# EAGLE design k22-brd (EAGLE 9.6.2)
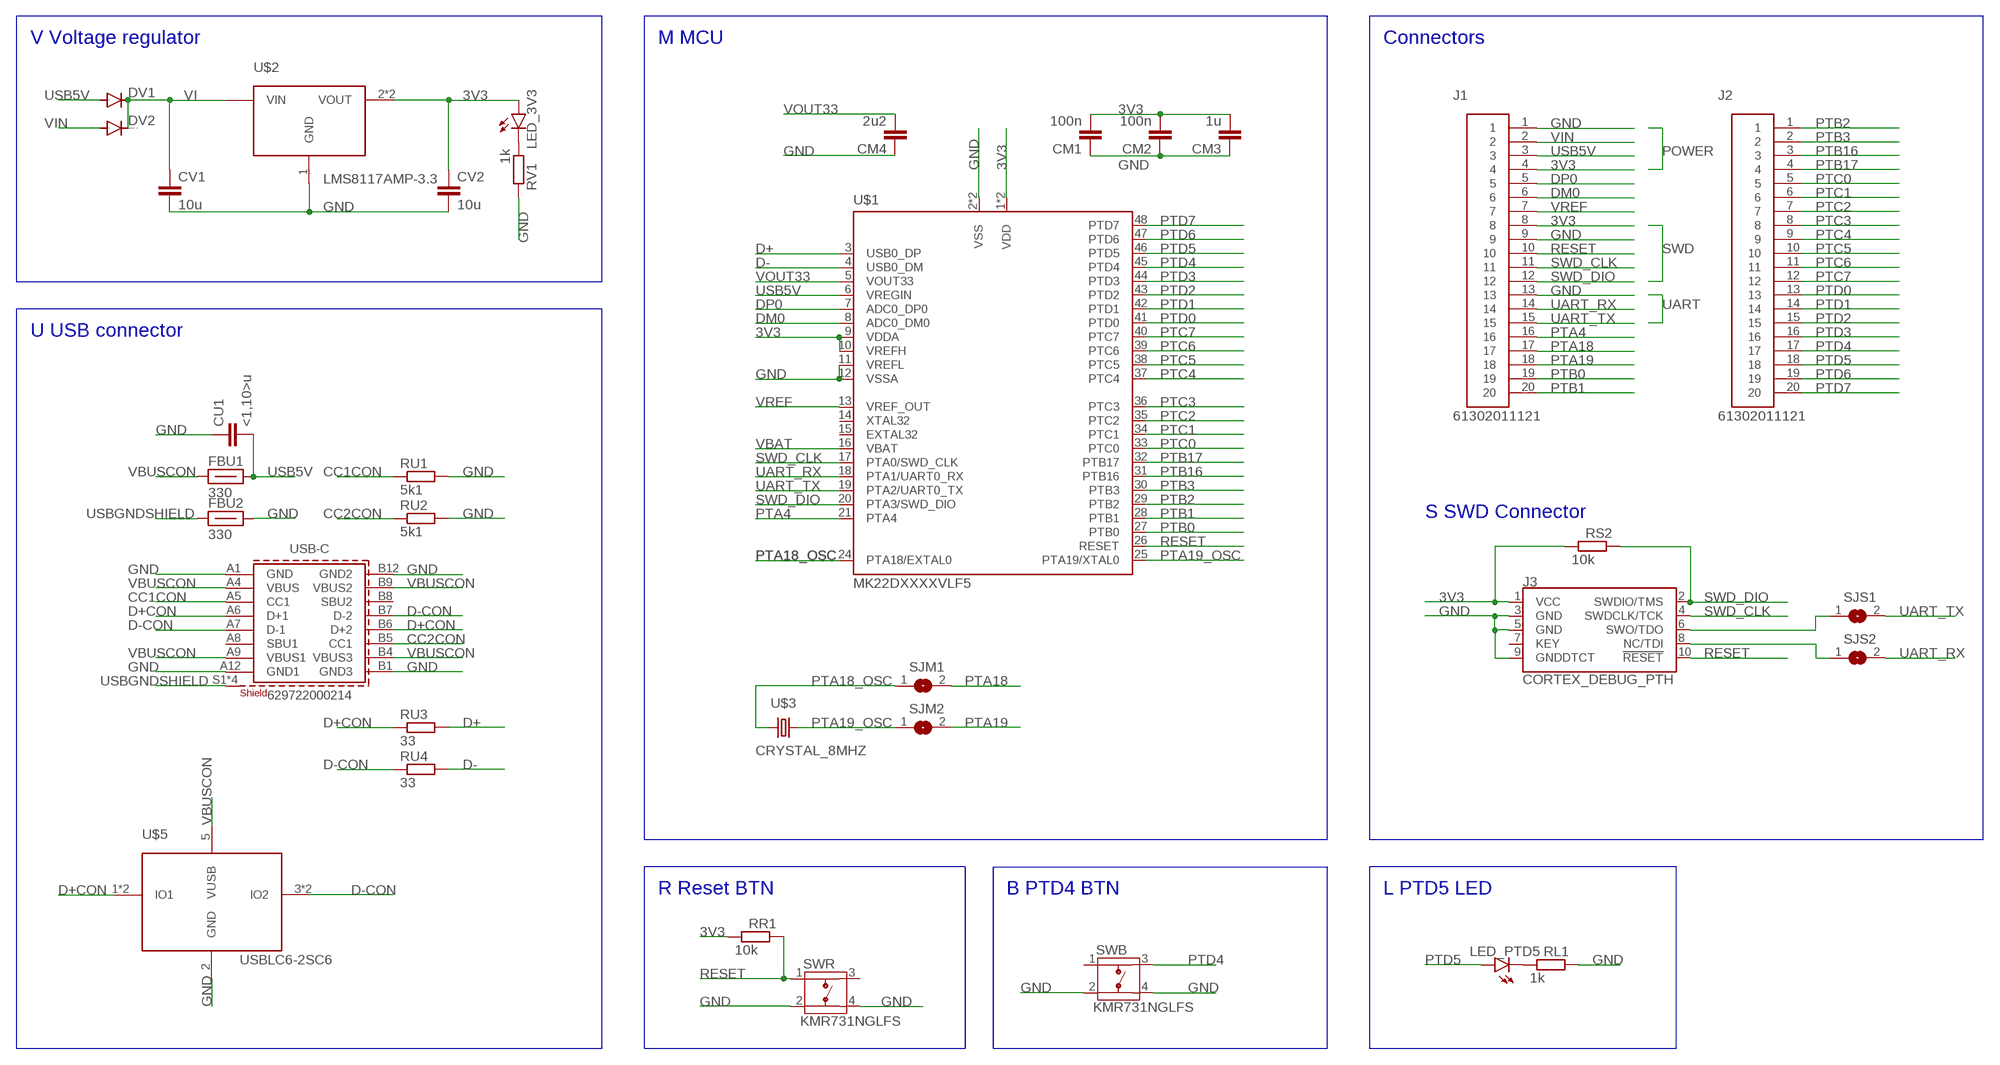
[diagram p0: schematic, sheet 1]

## Parts
CM1  100n  C-EUC0805  [C0805]
CM2  100n  C-EUC0805  [C0805]
CM3  1u  C-EUC0805  [C0805]
CM4  2u2  C-EUC0805  [C0805]
CU1  <1,10>u  C-EUC0805  [C0805]
CV1  10u  C-EUC0805  [C0805]
CV2  10u  C-EUC0805  [C0805]
DV1  DIODE-DO214AC  [DO214AC]
DV2  DIODE-DO214AC  [DO214AC]
FBU1  330  GHI-BASICCOMPONENTS_FB-(INCH)-0805  [GHI-BASICCOMPONENTS_0805-RESISTOR]
FBU2  330  GHI-BASICCOMPONENTS_FB-(INCH)-0805  [GHI-BASICCOMPONENTS_0805-RESISTOR]
J1  61302011121  [61302011121]
J2  61302011121  [61302011121]
J3  CORTEX_DEBUG_PTH  [2X5-PTH-1.27MM]
LED_3V3  LEDCHIP-LED0805  [CHIP-LED0805]
LED_PTD5  LEDCHIP-LED0805  [CHIP-LED0805]
RL1  1k  R-EU_M0805  [M0805]
RR1  10k  R-EU_M0805  [M0805]
RS2  10k  R-EU_M0805  [M0805]
RU1  5k1  R-EU_R0805  [R0805]
RU2  5k1  R-EU_R0805  [R0805]
RU3  33  R-EU_R0805  [R0805]
RU4  33  R-EU_R0805  [R0805]
RV1  1k  R-EU_M0805  [M0805]
SJM1  SJ  [SJ]
SJM2  SJ  [SJ]
SJS1  SJ  [SJ]
SJS2  SJ  [SJ]
SWB  KMR731NGLFS  [KMR731NGLFS]
SWR  KMR731NGLFS  [KMR731NGLFS]
U$1  MK22DXXXXVLF5  [TQFP48_7X7]
U$2  LMS8117AMP-3.3  [SOT223]
U$3  CRYSTAL_8MHZ  [CRYSTAL-SMD-5X3.2-2PAD]
U$5  USBLC6-2SC6  [SOT23-6L]
USB-C  629722000214  [629722000214]

## Nets
3V3: CM1.2 CM2.2 CM3.2 CV2.1 J1.4 J1.8 J3.1(VCC) LED_3V3.A RR1.1 RS2.1 U$1.1(VDD) U$1.9(VDDA) U$1.10(VREFH) U$1.22(VDD) U$2.2(VOUT) U$2.4(VOUT)
CC1CON: RU1.1 USB-C.A5(CC1)
CC2CON: RU2.1 USB-C.B5(CC1)
D+: RU3.2 U$1.3(USB0_DP)
D+CON: RU3.1 U$5.1(IO1) U$5.6(IO1) USB-C.A6(D+1) USB-C.B6(D+2)
D-: RU4.2 U$1.4(USB0_DM)
D-CON: RU4.1 U$5.3(IO2) U$5.4(IO2) USB-C.A7(D-1) USB-C.B7(D-2)
DM0: J1.6 U$1.8(ADC0_DM0)
DP0: J1.5 U$1.7(ADC0_DP0)
GND: CM1.1 CM2.1 CM3.1 CM4.1 CU1.1 CV1.2 CV2.2 FBU2.2 J1.1 J1.9 J1.13 J3.3(GND) J3.5(GND) J3.9(GNDDTCT) RL1.2 RU1.2 RU2.2 RV1.2 SWB.2 SWB.4 SWR.2 SWR.4 U$1.2(VSS) U$1.11(VREFL) U$1.12(VSSA) U$1.23(VSS) U$2.1(GND) U$5.2(GND) USB-C.A1(GND) USB-C.A12(GND1) USB-C.B1(GND3) USB-C.B12(GND2)
N$1: LED_PTD5.C RL1.1
N$2: LED_3V3.C RV1.1
N$3: J3.8(NC/TDI) SJS2.1
N$4: J3.6(SWO/TDO) SJS1.1
PTA4: J1.16 U$1.21(PTA4)
PTA18: J1.17 SJM1.2
PTA18_OSC: SJM1.1 U$1.24(PTA18/EXTAL0) U$3.1
PTA19: J1.18 SJM2.2
PTA19_OSC: SJM2.1 U$1.25(PTA19/XTAL0) U$3.2
PTB0: J1.19 U$1.27(PTB0)
PTB1: J1.20 U$1.28(PTB1)
PTB2: J2.1 U$1.29(PTB2)
PTB3: J2.2 U$1.30(PTB3)
PTB16: J2.3 U$1.31(PTB16)
PTB17: J2.4 U$1.32(PTB17)
PTC0: J2.5 U$1.33(PTC0)
PTC1: J2.6 U$1.34(PTC1)
PTC2: J2.7 U$1.35(PTC2)
PTC3: J2.8 U$1.36(PTC3)
PTC4: J2.9 U$1.37(PTC4)
PTC5: J2.10 U$1.38(PTC5)
PTC6: J2.11 U$1.39(PTC6)
PTC7: J2.12 U$1.40(PTC7)
PTD0: J2.13 U$1.41(PTD0)
PTD1: J2.14 U$1.42(PTD1)
PTD2: J2.15 U$1.43(PTD2)
PTD3: J2.16 U$1.44(PTD3)
PTD4: J2.17 SWB.3 U$1.45(PTD4)
PTD5: J2.18 LED_PTD5.A U$1.46(PTD5)
PTD6: J2.19 U$1.47(PTD6)
PTD7: J2.20 U$1.48(PTD7)
RESET: J1.10 J3.10(!RESET) RR1.2 SWR.1 U$1.26(RESET)
SWD_CLK: J1.11 J3.4(SWDCLK/TCK) U$1.17(PTA0/SWD_CLK)
SWD_DIO: J1.12 J3.2(SWDIO/TMS) RS2.2 U$1.20(PTA3/SWD_DIO)
UART_RX: J1.14 SJS2.2 U$1.18(PTA1/UART0_RX)
UART_TX: J1.15 SJS1.2 U$1.19(PTA2/UART0_TX)
USB5V: CU1.2 DV1.A FBU1.2 J1.3 U$1.6(VREGIN)
USBGNDSHIELD: FBU2.1 USB-C.S1(SHIELD) USB-C.S2(SHIELD) USB-C.S3(SHIELD) USB-C.S4(SHIELD)
VBAT: U$1.16(VBAT)
VBUSCON: FBU1.1 U$5.5(VUSB) USB-C.A4(VBUS) USB-C.A9(VBUS1) USB-C.B4(VBUS3) USB-C.B9(VBUS2)
VI: CV1.1 DV1.C DV2.C U$2.3(VIN)
VIN: DV2.A J1.2
VOUT33: CM4.2 U$1.5(VOUT33)
VREF: J1.7 U$1.13(VREF_OUT)
Unconnected: J3.7(KEY) SWB.1 SWR.3 U$1.14(XTAL32) U$1.15(EXTAL32) USB-C.A8(SBU1) USB-C.B8(SBU2)

## Notes on the sheet
- V Voltage regulator | M MCU | Connectors
- U USB connector
- S SWD Connector
- R Reset BTN | B PTD4 BTN | L PTD5 LED

## Library data of the parts
CM1-CM4 CU1 CV1 CV2 = rcl:C-EU: CAPACITOR, European symbol; SPICEPREFIX: C
DV1 DV2 = diode:DIODE-: DIODE
FBU1 FBU2 = BeagleBone_Black_Wireless:GHI-BASICCOMPONENTS_FB-(INCH)-
J1 J2 = Headers:61302011121: CONN HEADER VERT 20POS 2.54MM Manufacturer's datasheet <https://katalog.we-online.de/em/datasheet/6130xx11121.pdf>; CREATED_BY: PCBLayout.com; DIGIKEY_PART_NUMBER: 732-5329-ND; MANUFACTURER: Wurth Electronics Inc.; MPN: 61302011121
J3 = SparkFun-Connectors:CORTEX_DEBUG: Cortex Debug Connector - 10 pin Supports JTAG debug, Serial Wire debug, and Serial Wire Viewer. PTH and SMD connector options available. General Connector Information <http://infocenter.arm.com/help/topic/com.arm.doc.faqs/attached/13634/cortex_debug_connectors.pdf> Products: PTH Connector <http://www.digikey.com/product-detail/en/cnc-tech/3220-10-0100-00/1175-1627-ND/3883661> -via Digi-Key SparkFun PSoc <https://www.sparkfun.com/products/13229> SparkFun T <https://www.sparkfun.com/products/13810>
LED_3V3 LED_PTD5 = led:LED: LED OSRAM: - CHIPLED LG R971, LG N971, LY N971, LG Q971, LY Q971, LO R971, LY R971 LH N974, LH R974 LS Q976, LO Q976, LY Q976 LO Q996 - Hyper CHIPLED LW Q18S LB Q993, LB Q99A, LB R99A - SideLED LS A670, LO A670, LY A670, LG A670, LP A670 LB A673, LV A673, LT A673, LW A673 LH A674 LY A675 LS A676, LA A676, LO A676, LY A676, LW A676 LS A679, LY A679, LG A679 - Hyper Micro SIDELED® LS Y876, LA Y876, LO Y876, LY Y876 LT Y87S - SmartLED LW L88C, LW L88S LB L89C, LB L89S, LG L890 LS L89K, LO L89K, LY L89K LS L896, LA L896, LO L896, LY L896 - TOPLED LS T670, LO T670, LY T670, LG T670, LP T670 LSG T670, LSP T670, LSY T670, LOP T670, LYG T670 LG T671, LOG T671, LSG T671 LB T673, LV T673, LT T673, LW T673 LH T674 LS T676, LA T676, LO T676, LY T676, LB T676, LH T676, LSB T676, LW T676 LB T67C, LV T67C, LT T67C, LS T67K, LO T67K, LY T67K, LW E67C LS E67B, LA E67B, LO E67B, LY E67B, LB E67C, LV E67C, LT E67C LW T67C LS T679, LY T679, LG T679 LS T770, LO T770, LY T770, LG T770, LP T770 LB T773, LV T773, LT T773, LW T773 LH T774 LS E675, LA E675, LY E675, LS T675 LS T776, LA T776, LO T776, LY T776, LB T776 LHGB T686 LT T68C, LB T68C - Hyper Mini TOPLED® LB M676 - Mini TOPLED Santana® LG M470 LS M47K, LO M47K, LY M47K Source: http://www.osram.convergy.de LUXEON: - LUMILED® LXK2-PW12-R00, LXK2-PW12-S00, LXK2-PW14-U00, LXK2-PW14-V00 LXK2-PM12-R00, LXK2-PM12-S00, LXK2-PM14-U00 LXK2-PE12-Q00, LXK2-PE12-R00, LXK2-PE12-S00, LXK2-PE14-T00, LXK2-PE14-U00 LXK2-PB12-K00, LXK2-PB12-L00, LXK2-PB12-M00, LXK2-PB14-N00, LXK2-PB14-P00, LXK2-PB14-Q00 LXK2-PR12-L00, LXK2-PR12-M00, LXK2-PR14-Q00, LXK2-PR14-R00 LXK2-PD12-Q00, LXK2-PD12-R00, LXK2-PD12-S00 LXK2-PH12-R00, LXK2-PH12-S00 LXK2-PL12-P00, LXK2-PL12-Q00, LXK2-PL12-R00 Source: www.luxeon.com KINGBRIGHT: KA-3528ASYC Source: www.kingbright.com
RL1 RR1 RS2 RU1-RU4 RV1 = rcl:R-EU_: RESISTOR, European symbol; SPICEPREFIX: R
SJM1 SJM2 SJS1 SJS2 = jumper:SJ: SMD solder JUMPER
SWB SWR = Switch:KMR731NGLFS: SWITCH TACTILE SPST-NO 50MA 32V Manufacturer's datasheet <https://dznh3ojzb2azq.cloudfront.net/products/Tactile/KMR7/documents/datasheet.pdf>; CREATED_BY: PCBLayout.com; DIGIKEY_PARTNO: CKN10687CT-ND; MANUFACTURER: C&K; MPN: KMR731NG LFS
U$1 = poli-MK22:MK22DXXXXVLF5
U$2 = vym0038_k22_misc:LMS8117AMP-3.3
U$3 = vym0038_k22_misc:CRYSTAL_8MHZ
U$5 = vym0038_k22_misc:USBLC6-2SC6
USB-C = poli-USB-C:629722000214: WR-COM USB 2.0 Type C Plug Vertical SMT Kind Properties Durability 10 000 Mating cycles Gender Receptacle Type Horizontal General Information Operating Temperature -40 up to +85 °C Electrical Properties Working Voltage 20 V (DC) Withstanding Voltage 100 V (AC) Contact Resistance 40 mΩ Material Properties Insulator Material LCP Insulator Flammability Rating UL94 V-0 Insulator Color Black Contact Material Brass Contact Plating Gold over Nickel Contact Type Stamped Shielding Material Steel Shielding Plating Nickel (Ni) <https://www.we-online.com/catalog/media/o689297v209%20family-wr-com-629722000214.jpg> Details see: www.we-online.com/catalog/WR-COM_USB_20_TYPE_C_RECEPTACLE_HORIZONTAL_SMT Updated by Ella Wu 2022-05-09 2022 (C) Würth Elektronik; APPLICATION: USB 2.0; DATASHEET-URL: https://www.we-online.com/redexpert/spec/629722000214?ae; GERDER: Receptacle; INTERFACE-TYPE: Type C; IR: 5A; MOUNT: SMT; PACKAGING: Tape and Reel; PART-NUMBER: 629722000214; PINS: 16; TYPE: Horizontal; WORKING-VOLTAGE: 20V(AC)

## Board
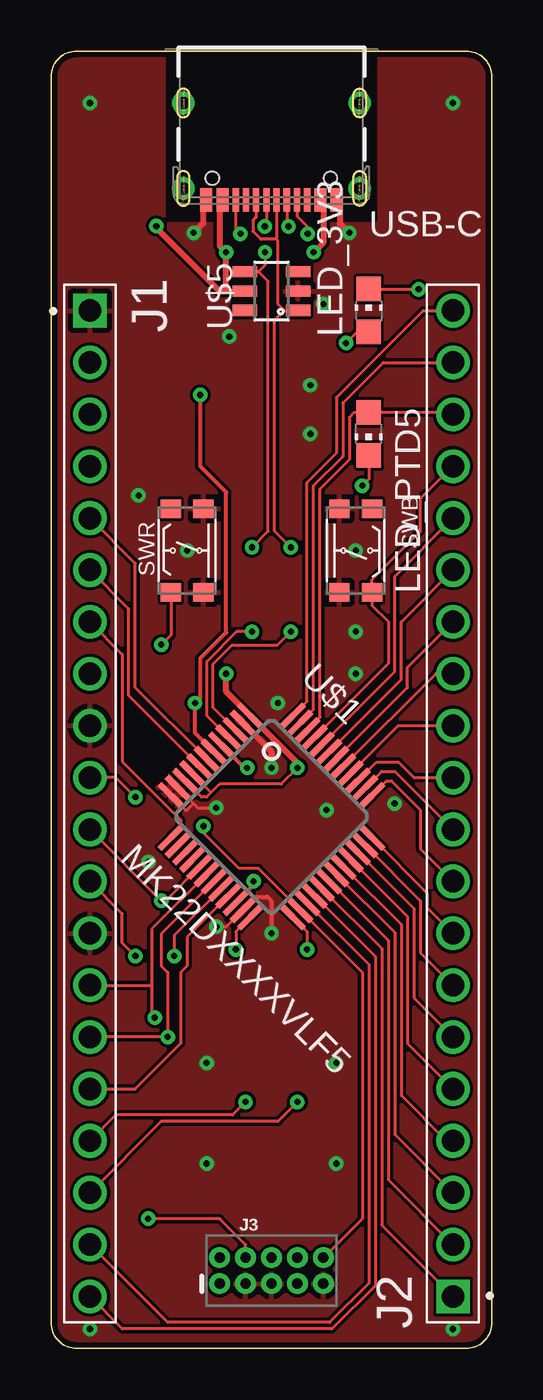
[diagram p1: board, top side]
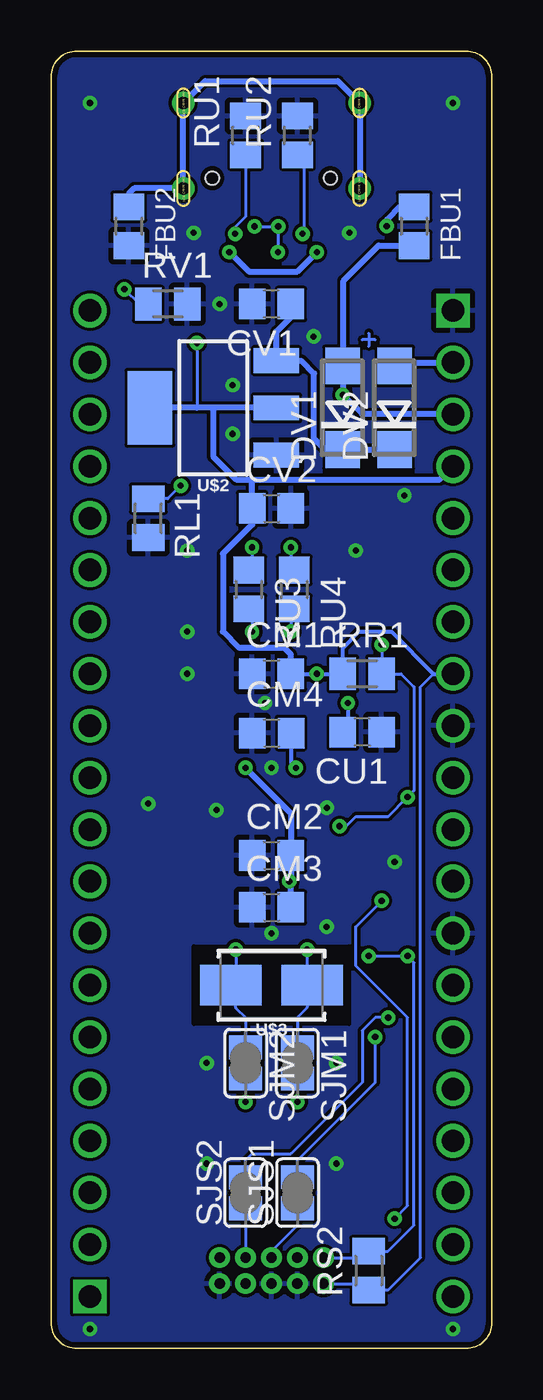
[diagram p2: board, bottom side, seen from below]

Size 21.59 x 63.5 mm. Coordinates in mm from the lower left corner, seen from the top.
Outline: 1.27,0 20.32,0 arc90 21.59,1.27 21.59,62.23 arc90 20.32,63.5 1.27,63.5 arc90 0,62.23 0,1.27 arc90 1.27,0
Copper layers (1*16): Top 0.035mm / dielectric 1.5mm / Bottom 0.035mm
Design rules "default *": minimum track width 6mil, minimum drill 0.3mm, track to track 6mil, track to pad 6mil, pad to pad 6mil, via to via 6mil, smd to smd 6mil, copper to edge 10mil, drill to drill 10mil, minimum pad ring 10mil, minimum via ring 8mil, stop-mask expansion 4mil, vias tented up to drill 0mil, thermal gap 10mil

### Footprints (pad centres in the part's own frame; a part is rotated, then mirrored left to right if it is on the bottom)
C0805 = smd 1.3 x 1.5: 1 -0.95,0; 2 0.95,0
DO214AC = smd 1.8 x 1.7: A 2.05,0; C -2.05,0
GHI-BASICCOMPONENTS_0805-RESISTOR = smd 1.3 x 1.5: 1 -0.95,0; 2 0.95,0
61302011121 = drill 1.1 square: 1 -24.13,0 | drill 1.1: 2 -21.59,0; 3 -19.05,0; 4 -16.51,0; 5 -13.97,0; 6 -11.43,0; 7 -8.89,0; 8 -6.35,0; 9 -3.81,0; 10 -1.27,0; 11 1.27,0; 12 3.81,0; 13 6.35,0; 14 8.89,0; 15 11.43,0; 16 13.97,0; 17 16.51,0; 18 19.05,0; 19 21.59,0; 20 24.13,0
2X5-PTH-1.27MM = drill 0.508 pad 1: 1 -2.54,-0.635; 2 -2.54,0.635; 3 -1.27,-0.635; 4 -1.27,0.635; 5 0,-0.635; 6 0,0.635; 7 1.27,-0.635; 8 1.27,0.635; 9 2.54,-0.635; 10 2.54,0.635
CHIP-LED0805 = smd 1.2 x 1.2: A 0,-1.05; C 0,1.05
M0805 = smd 1.3 x 1.6: 1 -0.95,0; 2 0.95,0
R0805 = smd 1.3 x 1.5: 1 -0.95,0; 2 0.95,0
SJ = smd 1.168 x 1.6: 1 -0.762,0; 2 0.762,0
KMR731NGLFS = smd 0.9 x 1: 1 -2.05,0.8; 2 -2.05,-0.8; 3 2.05,0.8; 4 2.05,-0.8
TQFP48_7X7 = smd 1.5 x 0.3: 1 -4.25,2.75; 2 -4.25,2.25; 3 -4.25,1.75; 4 -4.25,1.25; 5 -4.25,0.75; 6 -4.25,0.25; 7 -4.25,-0.25; 8 -4.25,-0.75; 9 -4.25,-1.25; 10 -4.25,-1.75; 11 -4.25,-2.25; 12 -4.25,-2.75; 25 4.25,-2.75; 26 4.25,-2.25; 27 4.25,-1.75; 28 4.25,-1.25; 29 4.25,-0.75; 30 4.25,-0.25; 31 4.25,0.25; 32 4.25,0.75; 33 4.25,1.25; 34 4.25,1.75; 35 4.25,2.25; 36 4.25,2.75 | smd 0.3 x 1.5: 13 -2.75,-4.25; 14 -2.25,-4.25; 15 -1.75,-4.25; 16 -1.25,-4.25; 17 -0.75,-4.25; 18 -0.25,-4.25; 19 0.25,-4.25; 20 0.75,-4.25; 21 1.25,-4.25; 22 1.75,-4.25; 23 2.25,-4.25; 24 2.75,-4.25; 37 2.75,4.25; 38 2.25,4.25; 39 1.75,4.25; 40 1.25,4.25; 41 0.75,4.25; 42 0.25,4.25; 43 -0.25,4.25; 44 -0.75,4.25; 45 -1.25,4.25; 46 -1.75,4.25; 47 -2.25,4.25; 48 -2.75,4.25
SOT223 = smd 1.219 x 2.235: 1 -2.311,-3.099; 2 0,-3.099; 3 2.311,-3.099 | smd 3.6 x 2.2: 4 0,3.099
CRYSTAL-SMD-5X3.2-2PAD = smd 3 x 2: 1 -2,0; 2 2,0
SOT23-6L = smd 0.55 x 1.2: 1 -0.95,-1.3; 2 0,-1.3; 3 0.95,-1.3; 4 0.95,1.3; 5 0,1.3; 6 -0.95,1.3
629722000214 = smd 0.3 x 1.15: A1 -3.35,4.745; A4 -2.55,4.745; A5 -1.25,4.745; A6 -0.25,4.745; A7 0.25,4.745; A8 1.25,4.745; A9 2.55,4.745; A12 3.35,4.745; B1 3.05,4.745; B4 2.25,4.745; B5 1.75,4.745; B6 0.75,4.745; B7 -0.75,4.745; B8 -1.75,4.745; B9 -2.25,4.745; B12 -3.05,4.745 | drill 0.6 pad 1: S1 -4.32,4.18; S2 4.32,4.18; S3 -4.32,0; S4 4.32,0 | hole 0.65: -2.89,3.68; 2.89,3.68

### Placement (x,y rotation side)
CM1  10.79,33.02 0 bottom
CM2  10.79,24.13 0 bottom
CM3  10.79,21.59 0 bottom
CM4  10.79,30.11 0 bottom
CU1  6.35,30.16 180 bottom
CV1  10.79,51.12 180 bottom
CV2  10.79,41.12 0 bottom
DV1  7.3,46.04 90 bottom
DV2  4.76,46.04 90 bottom
FBU1  3.81,54.93 270 bottom
FBU2  17.78,54.93 270 bottom
J1  1.91,26.67 270 top
J2  19.68,26.67 90 top
J3  10.79,3.81 0 top
LED_3V3  15.56,50.8 0 top
LED_PTD5  15.56,44.77 180 top
RL1  16.83,40.64 270 bottom
RR1  6.35,33.02 0 bottom
RS2  6.03,3.81 90 bottom
RU1  12.06,59.37 90 bottom
RU2  9.53,59.37 90 bottom
RU3  11.91,37.15 270 bottom
RU4  9.68,37.15 270 bottom
RV1  15.88,51.12 0 bottom
SJM1  9.53,13.97 270 bottom
SJM2  12.06,13.97 270 bottom
SJS1  9.52,7.62 90 bottom
SJS2  12.06,7.62 90 bottom
SWB  14.92,39.05 270 top
SWR  6.67,39.05 90 top
U$1  10.79,26.04 315 top
U$2  13.65,46.04 90 bottom
U$3  10.79,17.78 180 bottom
U$5  10.79,51.75 90 top
USB-C  10.79,60.96 180 top

### Tracks (layer width: path | path; a pad name or v marks a point on that pad's centre or on a via)
3V3  (via drill 0.3)
  Top 0.152: LED_3V3.A 14.98,49.75 v14.45,49.21 | U$1.10 7.37,26.99 7.62,26.99 7.85,27.21 | v12.06,28.42 11.27,27.62 8.26,27.62 7.85,27.21 | 7.85,27.21 U$1.9
  Top 0.203: v9.92,22.86 9.92,22.69 U$1.22
  Top 0.305: v8.57,33.02 8.57,32.15 U$1.1 12.06,28.65 v12.06,28.42
  Bottom 0.152: v14.45,49.21 14.45,46.04 | 2.86,33.02 3.49,32.38 3.49,4.45 5.08,2.86 RS2.1 6.35,3.17 J3.1
  Bottom 0.203: J1.8 2.86,33.02 4.92,35.08 6.51,35.08 7.3,34.29 RR1.1 v8.57,33.02 CM1.2
  Bottom 0.305: U$2.2 13.65,46.04 | 13.65,46.04 14.45,46.04 U$2.4 | J1.4 2.55,42.53 11.74,42.53 | CM1.2 9.85,33.98 10.16,34.29 12.38,34.29 13.18,35.08 13.18,38.89 11.75,40.32 CV2.1 11.74,42.53 | 9.85,22.79 CM2.2 9.84,26.19 v12.06,28.42 | 9.85,22.79 v9.92,22.86 | CM3.2 9.85,22.79 | 11.74,42.53 12.53,42.53 13.65,43.66 13.65,46.04
CC1CON  (via drill 0.3)
  Top 0.152: v12.57,54.56 v12.56,54.57 12.56,54.9 12.04,55.42 USB-C.A5
  Bottom 0.152: v12.57,54.56 v12.56,54.57 12.56,54.9 12.06,55.4 RU1.1
CC2CON  (via drill 0.3)
  Top 0.152: v9.27,54.56 9.04,54.78 USB-C.B5
  Bottom 0.152: v9.27,54.56 9.21,54.62 9.21,58.1 RU2.1
D+  (via drill 0.3)
  Top 0.152: U$1.3 7.94,31.37 7.94,33.5 8.88,34.43 11.1,34.43 v11.75,35.08
  Bottom 0.152: RU3.2 11.75,36.04 v11.75,35.08
D+CON  (via drill 0.3)
  Top 0.152: USB-C.B6 10.04,55.37 9.88,55.21 9.88,54.67 10.27,54.28 11.04,54.28 | USB-C.A6 11.04,54.28 | v11.75,39.21 10.95,40.01 10.95,50.32 11.43,50.8 | 11.43,50.8 11.11,51.12 11.11,54.22 11.04,54.28 | 11.43,50.8 U$5.1
  Bottom 0.152: v11.75,39.21 11.75,38.26 RU3.1
D-  (via drill 0.3)
  Top 0.152: U$1.4 7.63,30.96 7.63,33.62 9.09,35.08 v9.84,35.08
  Bottom 0.152: RU4.2 9.84,36.04 v9.84,35.08
D-CON  (via drill 0.3)
  Top 0.152: USB-C.A7 10.54,55 v10.46,54.91 | v11.63,54.91 11.54,55 USB-C.B7 | v9.84,39.21 10.64,40.01 10.64,52.23 10.16,52.7 U$5.4 10.16,52.7 10.48,53.02 v10.48,53.66
  Bottom 0.152: v11.63,54.91 v10.46,54.91 10.48,54.9 v10.48,53.66 | RU4.1 9.84,38.26 v9.84,39.21
DM0
  Top 0.152: U$1.8 3.81,31.96 3.81,36.2 J1.6
DP0
  Top 0.152: U$1.7 4.13,32.35 4.13,38.42 J1.5
GND  (via drill 0.3)
  Top 0.152: U$1.23 8.58,20.64 v8.1,20.64 | U$1.12 6.59,26.35 6.67,26.35 6.98,26.67 | U$1.11 6.98,26.67 | 6.98,26.67 7.19,26.46 v8.08,26.46
  Top 0.203: U$1.23 10.05,22.11 10.59,22.11 10.79,21.91 v10.79,20.32
  Top 0.305: U$1.2 10.79,29.22 v10.79,28.42 | USB-C.B1 USB-C.A12 7.45,55.07 v6.99,54.61 | USB-C.B12 USB-C.A1 14.14,55.07 v14.61,54.61
  other vias: 14.92,35.08 12.7,47.15 13.34,51.12 6.67,39.05 13.49,26.35 16.83,26.67 13.97,9.05 7.62,9.05 8.73,49.53 1.91,60.96 19.68,60.96 4.76,23.81 7.62,13.97 13.97,13.97 19.68,0.95 4.29,41.75 12.7,44.77 14.92,39.05 11.11,31.59 14.92,33.02 1.91,0.95
  pour Top: -1.91,64.77 -1.91,-1.27 23.5,-1.27 23.5,64.77
  pour Bottom: -1.91,65.97 -1.91,-1.27 23.5,-1.27 23.5,65.97
GNDCUTOU
  cutout Bottom: 7,19.68 7,15.88 14.61,15.88 14.61,19.68
  cutout Top: 5.71,63.82 5.71,55.24 15.88,55.24 15.88,63.82
N$1  (via drill 0.3)
  Top 0.152: LED_PTD5.C 15.56,42.55 v15.24,42.23
  Bottom 0.152: v15.24,42.23 15.88,41.59 RL1.1
N$2  (via drill 0.3)
  Top 0.152: LED_3V3.C v17.99,51.85 v18,51.84
  Bottom 0.152: RV1.1 16.83,51.13 17.29,51.13 v18,51.84
N$3
  Bottom 0.152: SJS2.1 J3.8
N$4
  Bottom 0.152: J3.6 10.79,4.76 9.53,6.03 SJS1.1
N$7
  Bottom 0.152: 5.71,49.37 6.35,49.37
N$8
  Bottom 0.152: 6.03,49.69 6.03,49.05
PTA4
  Top 0.152: U$1.21 6.67,20.14 6.67,18.73 6.35,18.41 6.35,14.92 4.13,12.7 J1.16
PTA18  (via drill 0.3)
  Top 0.152: v9.53,12.06 8.89,11.43 3.17,11.43 J1.17
  Bottom 0.152: SJM1.2 v9.53,12.06
PTA18_OSC  (via drill 0.3)
  Top 0.152: U$1.24 9.05,20.4 v9.05,19.53
  Bottom 0.152: v9.05,19.53 9.05,17.78 U$3.1 9.04,16.67 9.53,16.19 SJM1.1
PTA19  (via drill 0.3)
  Top 0.152: v12.06,12.06 11.11,11.11 5.4,11.11 J1.18
  Bottom 0.152: SJM2.2 v12.06,12.06
PTA19_OSC  (via drill 0.3)
  Top 0.152: U$1.25 12.54,20.4 v12.54,19.53
  Bottom 0.152: v12.54,19.53 12.54,17.78 U$3.2 12.54,16.67 12.06,16.19 SJM2.1
PTB0
  Top 0.152: J1.19 5.71,1.27 13.64,1.27 15.56,3.19 15.56,18.8 U$1.27
PTB1
  Top 0.152: J1.20 3.49,0.95 13.75,0.95 15.88,3.08 15.88,19.19 U$1.28
PTB2
  Top 0.152: U$1.29 16.19,19.58 16.19,6.03 J2.1
PTB3
  Top 0.152: U$1.30 16.51,19.97 16.51,8.26 J2.2
PTB16
  Top 0.152: U$1.31 16.83,20.36 16.83,10.48 J2.3
PTB17
  Top 0.152: U$1.32 17.14,20.75 17.14,12.38 19.37,10.16 J2.4
PTC0
  Top 0.152: U$1.33 17.46,21.14 17.46,14.92 J2.5
PTC1
  Top 0.152: U$1.34 17.78,21.52 17.78,17.14 J2.6
PTC2
  Top 0.152: U$1.35 18.1,21.91 18.1,19.37 J2.7
PTC3
  Top 0.152: U$1.36 18.41,22.3 18.41,21.59 J2.8
PTC4
  Top 0.152: U$1.37 16.43,27.78 16.67,27.78 18.1,26.35 18.1,24.45 J2.9
PTC5
  Top 0.152: U$1.38 16.19,28.25 16.84,28.25 J2.10
PTC6
  Top 0.152: U$1.39 15.94,28.7 17.02,28.7 17.78,27.94 J2.11
PTC7
  Top 0.152: U$1.40 17.01,30.48 J2.12
PTD0
  Top 0.152: U$1.41 18.84,33.02 J2.13
PTD1
  Top 0.152: U$1.42 17.46,32.35 17.46,33.34 J2.14
PTD2
  Top 0.152: U$1.43 17.14,32.74 17.14,35.56 J2.15
PTD3
  Top 0.152: U$1.44 16.83,33.13 16.83,37.78 J2.16
PTD4
  Top 0.152: U$1.45 16.51,33.52 16.51,35.58 15.72,36.37 SWB.3 15.72,37.63 18.1,40.01 18.1,41.59 J2.17
PTD5
  Top 0.152: J2.18 19.59,45.82 LED_PTD5.A 14.86,45.82 14.61,45.56 14.61,43.5 13.18,42.07 13.18,30.89 U$1.46
PTD6
  Top 0.152: U$1.47 12.86,31.28 12.86,42.23 14.29,43.66 14.29,46.28 16.27,48.26 J2.19
PTD7
  Top 0.152: U$1.48 12.54,31.67 12.54,42.39 13.97,43.81 13.97,46.54 18.23,50.8 J2.20
RESET  (via drill 0.3)
  Top 0.152: SWR.1 5.87,34.92 v5.4,34.45 | v4.13,26.99 3.17,27.94 J1.10 | J3.10 15.24,6.35 15.24,18.41 U$1.26 10.15,23.5 9.21,23.5 7.46,25.24 v7.46,25.56
  Bottom 0.152: v5.4,34.45 RR1.2 4.45,33.02 3.81,32.38 3.81,27.3 v4.13,26.99 5.08,26.04 6.67,26.04 7.14,25.56 v7.46,25.56
SWD_CLK  (via drill 0.3)
  Top 0.152: J3.4 9.53,5.08 8.26,6.35 v4.76,6.35 | J1.11 v5.4,21.91 5.61,21.91 U$1.17
  Bottom 0.152: v5.4,21.91 6.67,20.64 6.67,18.73 4.13,16.19 4.13,6.99 v4.76,6.35
SWD_DIO  (via drill 0.3)
  Top 0.152: U$1.20 6.03,20.21 v6.03,19.21 | v4.13,19.21 3.49,19.84 3.49,21.27 J1.12
  Bottom 0.152: v6.03,19.21 v4.13,19.21 3.81,18.89 3.81,6.03 5.08,4.76 RS2.2 6.35,4.45 J3.2
UART_RX  (via drill 0.3)
  Top 0.152: U$1.18 4.93,20.52 4.93,17.78 4.92,17.78 | J1.14 4.92,17.78 | 4.92,17.78 4.92,16.35 v5.08,16.19
  Bottom 0.152: SJS2.2 12.06,9.21 11.75,9.53 9.84,9.53 6.35,13.02 6.35,15.56 5.71,16.19 v5.08,16.19
UART_TX  (via drill 0.3)
  Top 0.152: U$1.19 5.4,20.28 5.4,18.73 5.71,18.41 v5.71,15.24 J1.15
  Bottom 0.152: SJS1.2 9.52,9.21 5.71,13.02 v5.71,15.24
USB5V  (via drill 0.3)
  Top 0.203: v7.3,46.67 7.3,43.18 8.57,41.91 8.57,35.03 7.3,33.76 7.3,31.84 v7.05,31.59 7.05,30.13 U$1.6
  Bottom 0.203: v7.05,31.59 7.05,30.41 CU1.2
  Bottom 0.305: J1.3 6.35,45.72 v7.3,46.67 DV1.A 7.27,48.12 7.27,52.26 5.55,53.98 FBU1.2
USBGNDSHIELD
  Bottom 0.305: USB-C.S2 USB-C.S4 7.55,62.03 14.04,62.03 USB-C.S3 USB-C.S1 17.52,56.78 17.78,56.52 FBU2.1
VBUSCON  (via drill 0.3)
  Top 0.203: U$5.5 8.57,51.75
  Top 0.305: USB-C.B9 USB-C.A4 13.34,56.2 13.34,54.13 v12.86,53.66 | USB-C.A9 USB-C.B4 8.26,55.92 8.26,53.98 v8.57,53.66 8.57,51.75 8.26,51.75 5.16,54.85 v5.16,54.94
  Bottom 0.305: v12.86,53.66 11.91,52.7 9.53,52.7 v8.57,53.66 | v5.16,54.94 5.12,54.97 5.12,55.25 4.5,55.88 FBU1.1
VI
  Bottom 0.305: CV1.1 9.85,50.48 10.55,49.77 U$2.3 9.33,48.35 8.71,47.72 8.71,44.52 8.17,43.99 DV1.C DV2.C
VIN
  Bottom 0.305: DV2.A 4.59,48.26 J1.2
VOUT33  (via drill 0.3)
  Top 0.203: v9.6,28.42 9.47,28.42 U$1.5
  Bottom 0.203: CM4.2 9.84,28.65 v9.6,28.42
VREF
  Top 0.152: J1.7 3.49,33.97 3.49,28.73 6.35,25.88 6.35,25.48 U$1.13

### Text on the board
bStop: JV & poli 2022
Popis: GND | PWR | D7 | + | VIN | D6 | + | USB5V | D5 | PTD5 | 3V3 | D4 | P0 | D3 | RST | PTD4 | M0 | D2 | VREF | D1 | 3V3 | D0 | GND | C7 | RST | C6 | SWC | K2x | C5 | SWD | C4 | GND | C3 | RX | C2 | TX | C1 | K22-KIT / v2.1 | A4 | C0 | A18 | B17 | A19 | B16 | B0 | B3 | B1 | 1 | B2